# Altium schematic sheet MCU.SchDoc
size A4; SheetNumber: 2; SheetTotal: 4
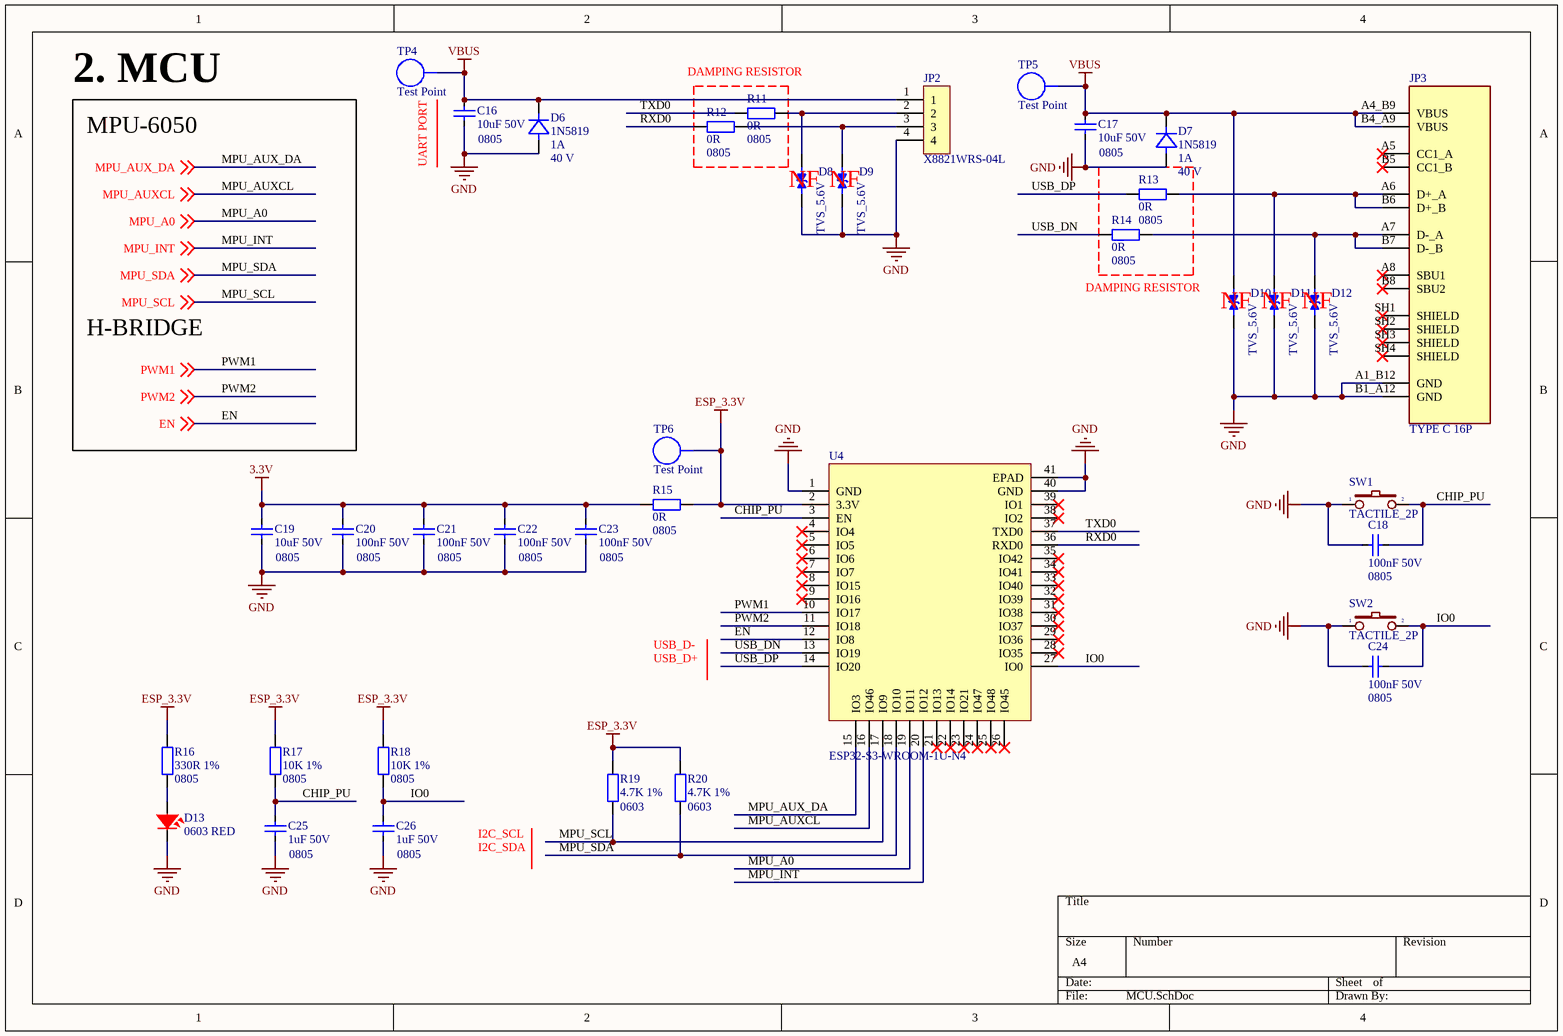
[diagram p0: MCU.SchDoc]

## Parts
C16  10uF 50V  Size: 0805  [CAP_SMD_0805_NEW]
C17  10uF 50V  Size: 0805  [CAP_SMD_0805_NEW]
C18  100nF 50V  Size: 0805  [CAP_SMD_0805_NEW]
C19  10uF 50V  Size: 0805  [CAP_SMD_0805_NEW]
C20  100nF 50V  Size: 0805  [CAP_SMD_0805_NEW]
C21  100nF 50V  Size: 0805  [CAP_SMD_0805_NEW]
C22  100nF 50V  Size: 0805  [CAP_SMD_0805_NEW]
C23  100nF 50V  Size: 0805  [CAP_SMD_0805_NEW]
C24  100nF 50V  Size: 0805  [CAP_SMD_0805_NEW]
C25  1uF 50V  Size: 0805  [CAP_SMD_0805_NEW]
C26  1uF 50V  Size: 0805  [CAP_SMD_0805_NEW]
D6  1N5819  Current - Average Rectified (Io): 1A  Voltage - DC Reverse (Vr) (Max): 40 V  [DIO-SMD-123]
D7  1N5819  Current - Average Rectified (Io): 1A  Voltage - DC Reverse (Vr) (Max): 40 V  [DIO-SMD-123]
D8  TVS_5.6V  [SOD_523]
D9  TVS_5.6V  [SOD_523]
D10  TVS_5.6V  [SOD_523]
D11  TVS_5.6V  [SOD_523]
D12  TVS_5.6V  [SOD_523]
D13  0603 RED  [LED-0603]
JP2  X8821WRS-04L  [CONN_X8821WRS-04L-LPSN]
JP3  TYPE C 16P  [TYPE C 16P]
R11  0R  Size: 0805  [RES_SMD_0805]
R12  0R  Size: 0805  [RES_SMD_0805]
R13  0R  Size: 0805  [RES_SMD_0805]
R14  0R  Size: 0805  [RES_SMD_0805]
R15  0R  Size: 0805  [RES_SMD_0805]
R16  330R 1%  Size: 0805  [RES_SMD_0805]
R17  10K 1%  Size: 0805  [RES_SMD_0805]
R18  10K 1%  Size: 0805  [RES_SMD_0805]
R19  4.7K 1%  Size: 0603  [RES_SMD_0603]
R20  4.7K 1%  Size: 0603  [RES_SMD_0603]
SW1  TACTILE_2P  [C&K SW 2P]
SW2  TACTILE_2P  [C&K SW 2P]
TP4  Test Point  [TEST_POINT]
TP5  Test Point  [TEST_POINT]
TP6  Test Point  [TEST_POINT]
U4  ESP32-S3-WROOM-1U-N4  [ESP32-S3-WROOM-1U]

## Nets
3.3V: C19.2 C20.2 C21.2 C22.2 C23.2 R15.2
ESP_3.3V: R15.1 R16.2 R17.2 R18.2 R19.2 R20.2 TP6.1 U4.2(3.3V)
GND: C16.1 C17.1 C18.2 C19.1 C20.1 C21.1 C22.1 C23.1 C24.2 C25.1 C26.1 D6.A D7.A D8.1 D9.1 D10.1 D11.1 D12.1 D13.2 JP2.4 JP3.A1_B12(GND) JP3.B1_A12(GND) SW1.1 SW2.1 U4.1(GND) U4.40(GND) U4.41(EPAD)
VBUS: C16.2 C17.2 D6.C D7.C D10.2 JP2.1 JP3.A4_B9(VBUS) JP3.B4_A9(VBUS) TP4.1 TP5.1
CHIP_PU: C18.1 C25.2 R17.1 SW1.2 U4.3(EN)
EN: U4.12(IO8) ; off-sheet EN
IO0: C24.1 C26.2 R18.1 SW2.2 U4.27(IO0)
MPU_A0: U4.19(IO11) ; off-sheet MPU_A0
MPU_AUX_DA: U4.15(IO3) ; off-sheet MPU_AUX_DA
MPU_AUXCL: U4.16(IO46) ; off-sheet MPU_AUXCL
MPU_INT: U4.20(IO12) ; off-sheet MPU_INT
MPU_SCL: R19.1 U4.17(IO9) ; off-sheet MPU_SCL
MPU_SDA: R20.1 U4.18(IO10) ; off-sheet MPU_SDA
PWM1: U4.10(IO17) ; off-sheet PWM1
PWM2: U4.11(IO18) ; off-sheet PWM2
RXD0: R12.2 U4.36(RXD0)
TXD0: R11.2 U4.37(TXD0)
USB_DN: R14.2 U4.13(IO19)
USB_DP: R13.2 U4.14(IO20)
NetD8_2: D8.2 JP2.2 R11.1
NetD9_2: D9.2 JP2.3 R12.1
NetD11_2: D11.2 JP3.A6(D+_A) JP3.B6(D+_B) R13.1
NetD12_2: D12.2 JP3.A7(D-_A) JP3.B7(D-_B) R14.1
NetD13_1: D13.1 R16.1

Not connected (* = marked no-connect by the designer): JP3 A5(CC1_A)* A8(SBU1)* B5(CC1_B)* B8(SBU2)* SH1(SHIELD)* SH2(SHIELD)* SH3(SHIELD)* SH4(SHIELD)*; U4 4(IO4)* 5(IO5)* 6(IO6)* 7(IO7)* 8(IO15)* 9(IO16)* 21(IO13)* 22(IO14)* 23(IO21)* 24(IO47)* 25(IO48)* 26(IO45)* 28(IO35)* 29(IO36)* 30(IO37)* 31(IO38)* 32(IO39)* 33(IO40)* 34(IO41)* 35(IO42)* 38(IO2)* 39(IO1)*

## Notes on the sheet
- 2. MCU
- DAMPING RESISTOR
- MPU-6050
- UART PORT
- (near D8) NF
- (near D9) NF
- (near D10) NF
- (near D11) NF
- (near D12) NF
- H-BRIDGE
- USB_D-
- USB_D+
- I2C_SCL
- I2C_SDA

## Library data of the parts
C16 C17 C19 = C0805_MLCC_10uF_50V: 10 µF ±20% 50V Ceramic Capacitor X5R 0805 (2012 Metric); Manufacturer: Murata Electronics; Manufacture Part Number: GRM21BR61H106ME43L; Packaging: Cut Tape (CT); Link: https://www.digikey.cn/en/products/detail/murata-electronics/GRM21BR61H106ME43L/10326317; Price: $0.34
C18 C20-C24 = C0805_MLCC_100nF_50V: 0.1 µF ±10% 50V Ceramic Capacitor X7R 0805 (2012 Metric); Manufacturer: YAGEO; Manufacture Part Number: CC0805KRX7R9BB104; Packaging: Cut Tape (CT); Link: https://www.digikey.cn/en/products/detail/yageo/CC0805KRX7R9BB104/302874; Price: $0.10
C25 C26 = C0805_MLCC_1uF_50V: 1 µF ±10% 50V Ceramic Capacitor X7R 0805 (2012 Metric); Manufacturer: Samsung Electro-Mechanics; Manufacture Part Number: CL21B105KBFNNNG; Packaging: Cut Tape (CT); Link: https://www.digikey.cn/en/products/detail/samsung-electro-mechanics/CL21B105KBFNNNG/3894467; Price: $0.11
D6 D7 = 1N5819: Diode 40 V 1A Surface Mount SOD-123; Manufacturer: Diodes Incorporated; Manufacture Part Number: 1N5819HW-7-F; Voltage - Forward (Vf) (Max) @ If: 450 mV @ 1 A; Capacitance @ Vr, F: 60pF @ 4V, 1MHz; Packaging: Cut Tape (CT); Link: https://www.digikey.cn/en/products/detail/diodes-incorporated/1N5819HW-7-F/814970; Price: $0.43; Operating Temperature - Junction: -65°C ~ 125°C
D8-D12 = TVS_5.6V: 9.4A 18.6V 5.6V Bi-Directional 5V SOD-523 Electrostatic and Surge Protection (TVS/ESD) ROHS; Manufacturer: LRC; Manufacture Part Number: LESD5D5.0CT1G; Voltage - Reverse Standoff (Typ): 4V; Voltage - Breakdown (Min): 6V; Voltage - Clamping (Max) @ Ipp: 8V; Packaging: Cut Tape (CT); Link: https://www.lcsc.com/product-detail/New-Arrivals_Leshan-Radio-LESD5D5-0CT1G_C383211.html; Price: $ 0.0149
D13 = LED_0603_RED: Red 625nm LED Indication - Discrete 2V 0603 (1608 Metric); Manufacturer: Würth Elektronik; Manufacture Part Number: 150060RS75000; Packaging: Cut Tape (CT); Link: https://www.digikey.cn/en/products/detail/w%C3%BCrth-elektronik/150060RS75000/4489901; Price: $0.15
JP2 = X8821WRS-04L: 1x4P 4P XH 1 Tin 2.5mm 4 3A Brass Surface Mount，Right Angle SMD,P=2.5mm,Surface Mount，Right Angle Wire To Board Connector ROHS; Manufacturer: XKB Connection; Manufacture Part Number: X8821WRS-04-9TSN; Link: https://www.lcsc.com/product-detail/Wire-To-Board-Connector_XKB-Connection-X8821WRS-04-9TSN_C397434.html; Price: $ 0.1564
JP3 = TYPE_C_16P: USB-C (USB TYPE-C) USB 2.0 Receptacle Connector 24 (16+8 Dummy) Position Surface Mount, Right Angle; Through Hole; Manufacturer: Amphenol ICC (Commercial Products); Manufacture Part Number: 12402012E212A; Packaging: Cut Tape; Link: https://www.digikey.cn/en/products/detail/amphenol-cs-commercial-products/12402012E212A/13683192; Price: $0.79
R11-R15 = R0805_0R: 0 Ohms Jumper Chip Resistor 0805 (2012 Metric) Automotive AEC-Q200 Thick Film; Manufacturer: Vishay Dale; Manufacture Part Number: CRCW08050000Z0EA; Packaging: Cut Tape (CT); Link: https://www.digikey.cn/en/products/detail/vishay-dale/CRCW08050000Z0EA/1175125; Price: $0.10
R16 = R0805_330R: 330 Ohms ±1% 0.125W, 1/8W Chip Resistor 0805 (2012 Metric) Automotive AEC-Q200 Thick Film; Manufacturer: Stackpole Electronics Inc; Manufacture Part Number: RMCF0805FT330R; Packaging: Cut Tape (CT); Link: https://www.digikey.cn/en/products/detail/stackpole-electronics-inc/RMCF0805FT330R/1760484; Price: $0.10
R17 R18 = R0805_10K: 10 kOhms ±1% 0.125W, 1/8W Chip Resistor 0805 (2012 Metric) Moisture Resistant Thick Film; Manufacturer: YAGEO; Manufacture Part Number: RC0805FR-0710KL; Packaging: Cut Tape (CT); Price: $0.10; Link: https://www.digikey.cn/en/products/detail/yageo/RC0805FR-0710KL/727535
R19 R20 = R0603_4.7K: 4.7 kOhms ±1% 0.1W, 1/10W Chip Resistor 0603 (1608 Metric) Moisture Resistant Thick Film; Manufacturer: YAGEO; Manufacture Part Number: RC0603FR-074K7L; Packaging: Cut Tape (CT); Link: https://www.digikey.com/en/products/detail/yageo/RC0603FR-074K7L/727212; Price: $0.10
SW1 SW2 = SWITCH_TACTILE_SPST: Tactile Switch SPST-NO Top Actuated Surface Mount; Manufacturer: C&K; Manufacture Part Number: PTS636 SM25F SMTR LFS; Packaging: Cut Tape (CT); Link: https://www.digikey.cn/en/products/detail/c-k/PTS636-SM25F-SMTR-LFS/10071742?s=N4IgTCBcDaIAoBUDKA2AzCgBEgsmArAGLY4IBKmAMoUiALoC%2BQA; Price: $0.24
TP4-TP6 = TEST_POINT
U4 = ESP32-S3-WROOM-1U-N4: SMD,18x19.2mm WiFi Modules ROHS; Manufacturer: Espressif Systems; Manufacture Part Number: ESP32-S3-WROOM-1U-N4; Packaging: Cut Tape (CT); Link: https://www.lcsc.com/product-detail/WiFi-Modules_Espressif-Systems-ESP32-S3-WROOM-1U-N4_C2980296.html; Price: $ 3.72